# EAGLE design Water Use Monitor (EAGLE 6.5.0)

## Sheet 1 of 2
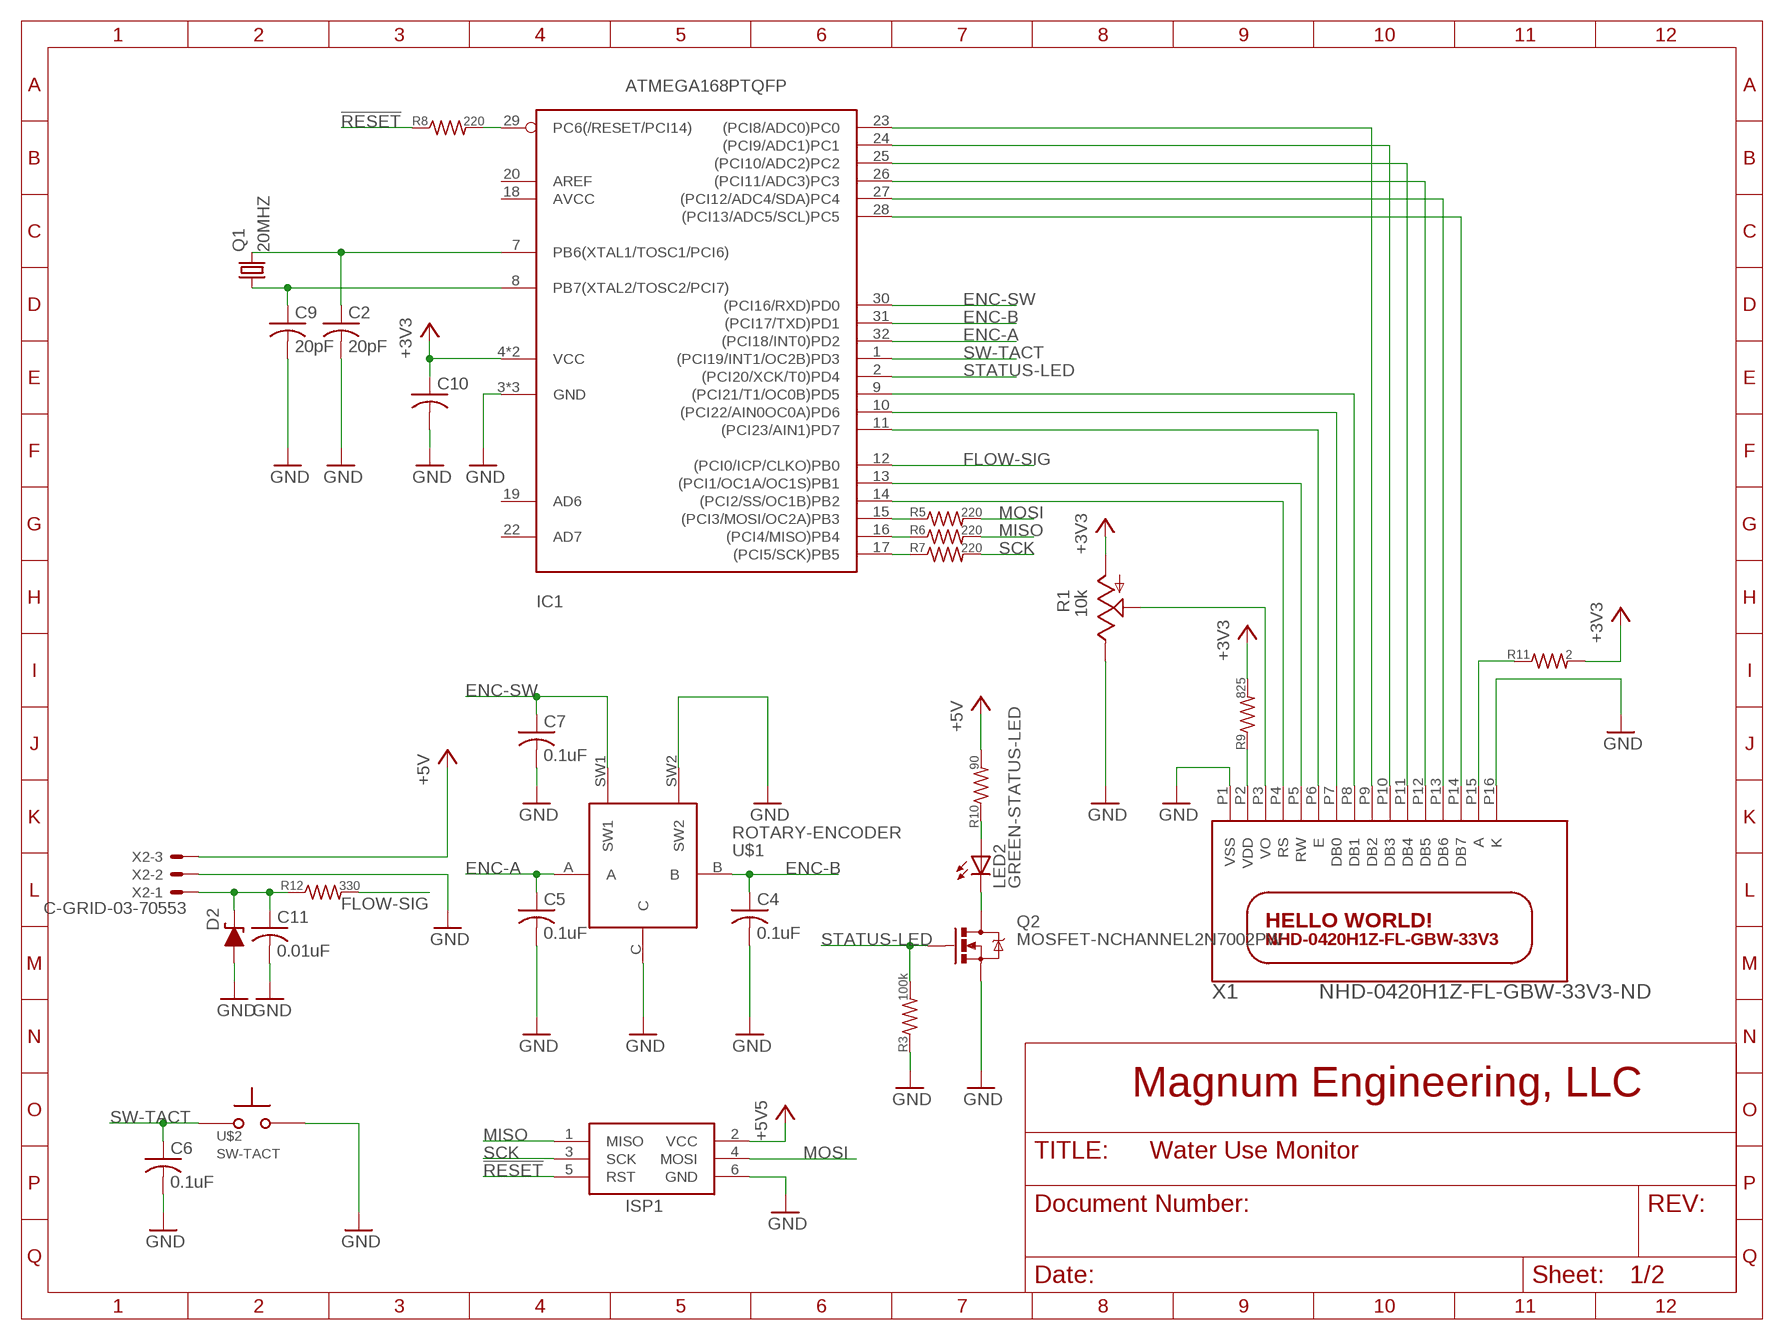
[diagram p0: schematic, sheet 1]

### Parts
C2  20pF  CAPACITOR0805  [C0805]
C4  0.1uF  CAPACITOR0805  [C0805]
C5  0.1uF  CAPACITOR0805  [C0805]
C6  0.1uF  CAPACITOR0805  [C0805]
C7  0.1uF  CAPACITOR0805  [C0805]
C9  20pF  CAPACITOR0805  [C0805]
C10  CAPACITOR0805  [C0805]
C11  0.01uF  CAPACITOR0805  [C0805]
D2  ZENERSOD-123  [SOD-123]
IC1  ATMEGA168PTQFP  [ADS4_TQFP32-08]
ISP1  AVRISP-6  [AVRISP]
LED2  GREEN-STATUS-LED  LED5MM  [LED5MM]
Q1  20MHZ  CRYSTAL  [20MHZ]
Q2  MOSFET-NCHANNEL2N7002PW  [SOT323]
R1  10k  POTENTIOMETER  [POT_RS3]
R3  100k  RESISTOR0805  [R0805]
R5  220  RESISTOR0805  [R0805]
R6  220  RESISTOR0805  [R0805]
R7  220  RESISTOR0805  [R0805]
R8  220  RESISTOR0805  [R0805]
R9  825  RESISTOR0805  [R0805]
R10  90  RESISTOR0805  [R0805]
R11  2  RESISTOR0805  [R0805]
R12  330  RESISTOR0805  [R0805]
U$1  ROTARY-ENCODER  [ROTARY-ENCODER]
U$2  SW-TACT  [FSM15JLH]
X1  NHD-0420H1Z-FL-GBW-33V3-ND  HD44780LCD  [NEWHAVEN-LCD]
X2  C-GRID-03-70553  [70553-03]

### Nets
!RESET: ISP1.5(RST) R8.1
$N32: C11.1 D2.K R12.1 X2.1
+3V3: C10.1 IC1.4(VCC) IC1.6(VCC) R1.A R9.2 R11.2 ; also sheet 2
+5.5V: ISP1.2(VCC) ; supply symbol labelled +5V5
+5V: R10.2 X2.3 ; also sheet 2
ENC-A: C5.1 IC1.32((PCI18/INT0)PD2) U$1.A
ENC-B: C4.1 IC1.31((PCI17/TXD)PD1) U$1.B
ENC-SW: C7.1 IC1.30((PCI16/RXD)PD0) U$1.SW1
FLOW-SIG: IC1.12((PCI0/ICP/CLKO)PB0) R12.2
GND: C2.2 C4.2 C5.2 C6.2 C7.2 C9.2 C10.2 C11.2 D2.A IC1.3(GND) IC1.5(GND) IC1.21(GND) ISP1.6(GND) Q2.2(S) R1.E R3.1 U$1.C U$1.SW2 U$2.P$3 U$2.P$4 X1.P1(VSS) X1.P16(K) X2.2 ; also sheet 2
MISO: ISP1.1(MISO) R6.2
MOSI: ISP1.4(MOSI) R5.2
N$1: R1.S X1.P3(VO)
N$2: IC1.13((PCI1/OC1A/OC1S)PB1) X1.P5(RW)
N$3: IC1.14((PCI2/SS/OC1B)PB2) X1.P4(RS)
N$4: IC1.11((PCI23/AIN1)PD7) X1.P6(E)
N$5: IC1.10((PCI22/AIN0OC0A)PD6) X1.P7(DB0)
N$6: IC1.9((PCI21/T1/OC0B)PD5) X1.P8(DB1)
N$7: IC1.23((PCI8/ADC0)PC0) X1.P9(DB2)
N$8: IC1.24((PCI9/ADC1)PC1) X1.P10(DB3)
N$9: IC1.25((PCI10/ADC2)PC2) X1.P11(DB4)
N$10: IC1.26((PCI11/ADC3)PC3) X1.P12(DB5)
N$11: IC1.27((PCI12/ADC4/SDA)PC4) X1.P13(DB6)
N$12: IC1.28((PCI13/ADC5/SCL)PC5) X1.P14(DB7)
N$15: C2.1 IC1.7(PB6(XTAL1/TOSC1/PCI6)) Q1.P$2
N$16: C9.1 IC1.8(PB7(XTAL2/TOSC2/PCI7)) Q1.P$1
N$18: IC1.15((PCI3/MOSI/OC2A)PB3) R5.1
N$19: IC1.16((PCI4/MISO)PB4) R6.1
N$20: IC1.17((PCI5/SCK)PB5) R7.1
N$21: IC1.29(PC6(/RESET/PCI14)) R8.2
N$22: R11.1 X1.P15(A)
N$26: LED2.K(C) Q2.3(D)
N$27: LED2.A R10.1
SCK: ISP1.3(SCK) R7.2
STATUS-LED: IC1.2((PCI20/XCK/T0)PD4) Q2.1(G) R3.2
SW-TACT: C6.1 IC1.1((PCI19/INT1/OC2B)PD3) U$2.P$1 U$2.P$2
VDD: R9.1 X1.P2(VDD)
Unconnected: IC1.18(AVCC) IC1.19(AD6) IC1.20(AREF) IC1.22(AD7)

## Sheet 2 of 2
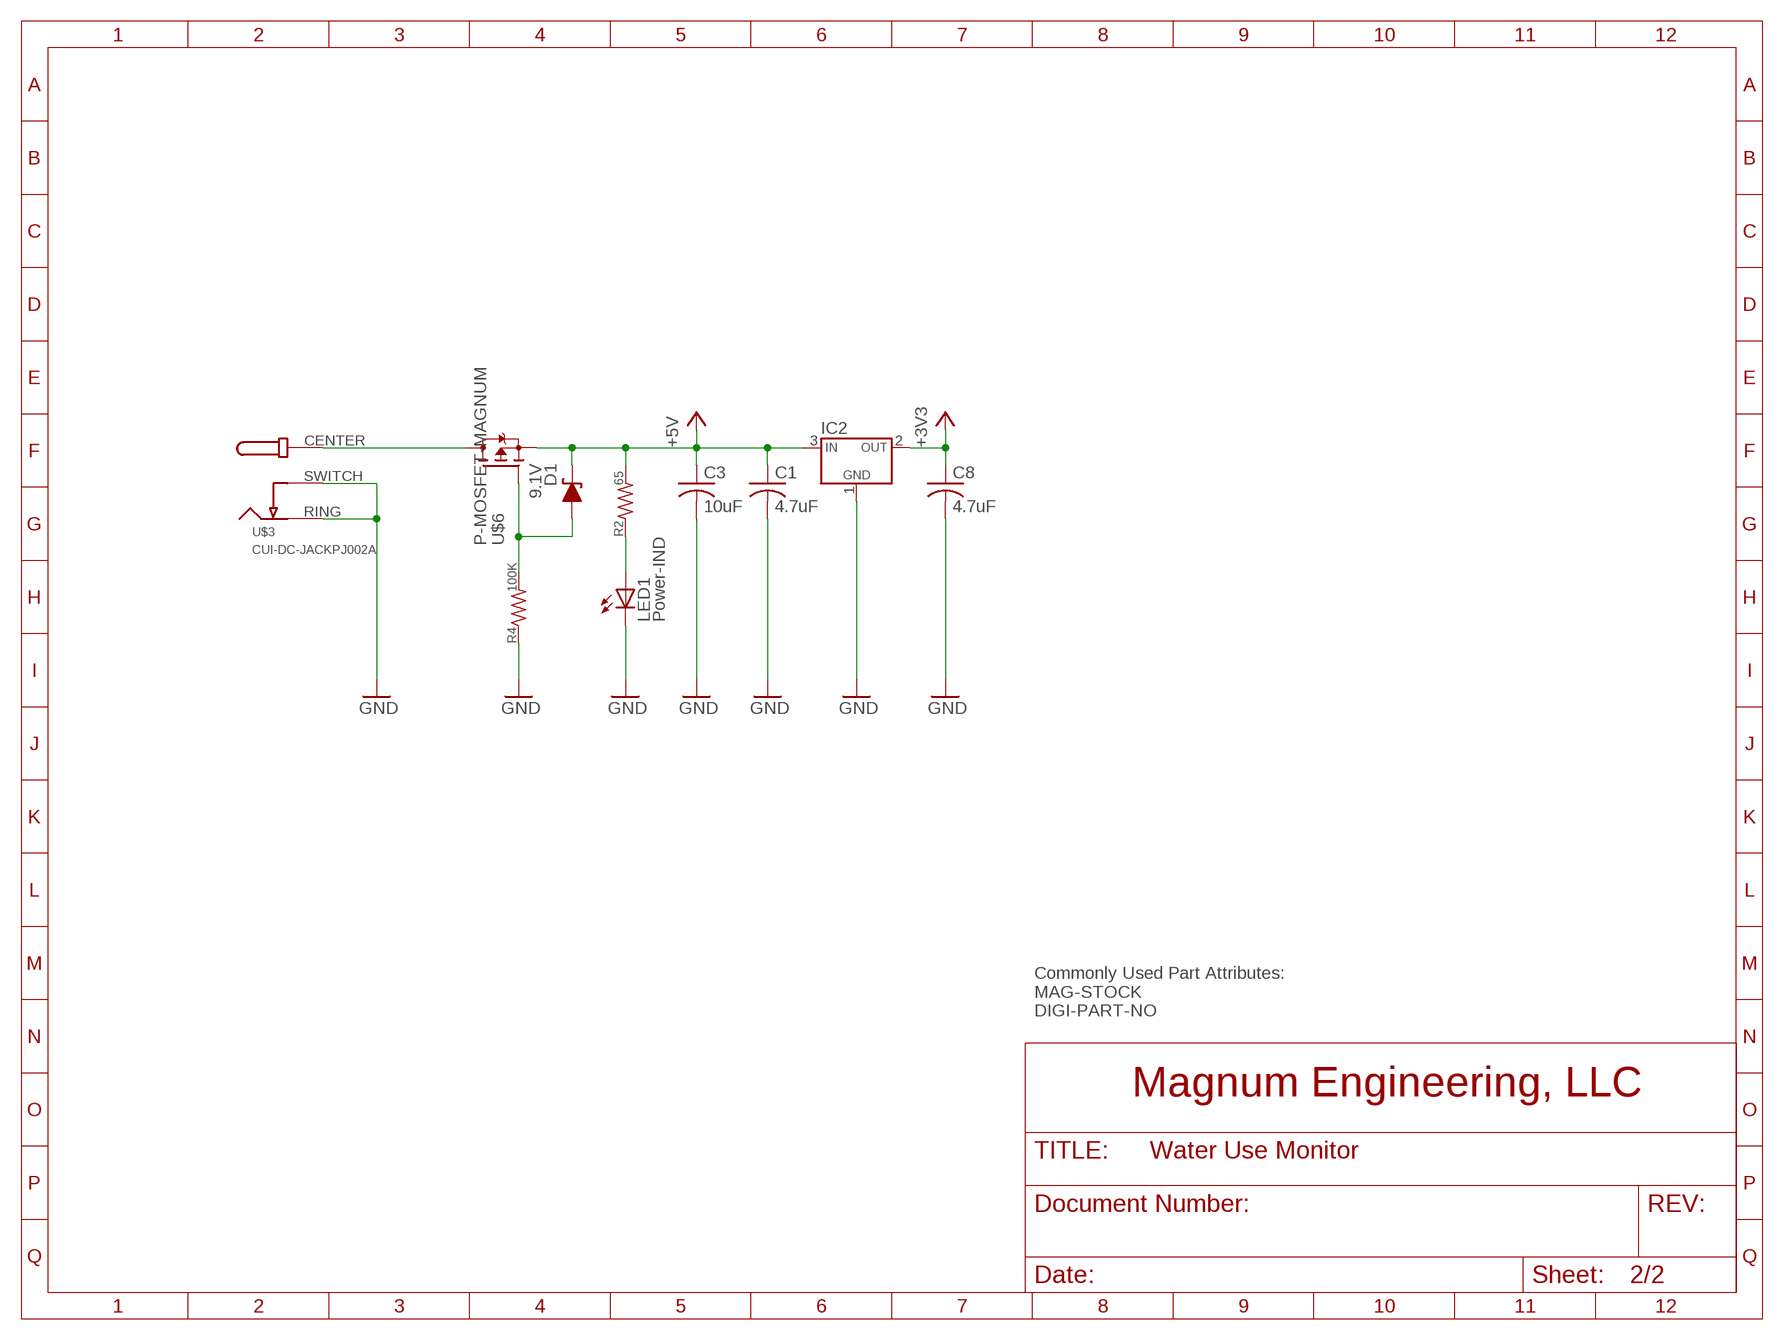
[diagram p1: schematic, sheet 2]

### Parts
C1  4.7uF  CAPACITOR0805  [C0805]
C3  10uF  CAPACITOR0805  [C0805]
C8  4.7uF  CAPACITOR0805  [C0805]
D1  9.1V  ZENERSOT-23  [SOT-23]
IC2  VREGLD1117-XX  [DPAK]
LED1  Power-IND  LED5MM  [LED5MM]
R2  65  RESISTOR0805  [R0805]
R4  100K  RESISTOR0805  [R0805]
U$3  CUI-DC-JACKPJ002A  [PJ002A]
U$6  P-MOSFET-MAGNUM  [SOT23]

### Nets
+3V3: C8.1 IC2.2(OUT) ; also sheet 1
+5V: C1.1 C3.1 D1.3(K) IC2.3(IN) R2.2 U$6.2(S) ; also sheet 1
GND: C1.2 C3.2 C8.2 IC2.1(GND) LED1.K(C) R4.1 U$3.RING U$3.SWITCH(SW) ; also sheet 1
N$13: U$3.CENTER U$6.3(D)
N$14: D1.1(A) R4.2 U$6.1(G)
N$17: LED1.A R2.1

### Notes on the sheet
- Commonly Used Part Attributes:
  MAG-STOCK
  DIGI-PART-NO

## Library data of the parts
C1-C11 = Magnum Stock Parts:CAPACITOR
D1 = Magnum Stock Parts:ZENER: Zener Diode; DIGI-PART-NO: BZX84C9V1-FDICT-ND
D2 = Magnum Stock Parts:ZENER: Zener Diode
IC1 = Water Use:ATMEGA168*P: MICROCONTROLLER 16 kBytes FLASH 1 kBytes SRAM 512 Bytes EEPROM USART 8-channel 10 bit ADC; DIGI-PART-NO: ATMEGA168PA-AURCT-ND
IC2 = Magnum Stock Parts:VREG; MAG-STOCK: YES
ISP1 = Water Use:AVRISP: AVR ISP HEADER Standard 6 pin header for AVR programming
LED1 = led:LED: LED OSRAM: - CHIPLED LG R971, LG N971, LY N971, LG Q971, LY Q971, LO R971, LY R971 LH N974, LH R974 LS Q976, LO Q976, LY Q976 LO Q996 - Hyper CHIPLED LW Q18S LB Q993, LB Q99A, LB R99A - SideLED LS A670, LO A670, LY A670, LG A670, LP A670 LB A673, LV A673, LT A673, LW A673 LH A674 LY A675 LS A676, LA A676, LO A676, LY A676, LW A676 LS A679, LY A679, LG A679 - Hyper Micro SIDELED® LS Y876, LA Y876, LO Y876, LY Y876 LT Y87S - SmartLED LW L88C, LW L88S LB L89C, LB L89S, LG L890 LS L89K, LO L89K, LY L89K LS L896, LA L896, LO L896, LY L896 - TOPLED LS T670, LO T670, LY T670, LG T670, LP T670 LSG T670, LSP T670, LSY T670, LOP T670, LYG T670 LG T671, LOG T671, LSG T671 LB T673, LV T673, LT T673, LW T673 LH T674 LS T676, LA T676, LO T676, LY T676, LB T676, LH T676, LSB T676, LW T676 LB T67C, LV T67C, LT T67C, LS T67K, LO T67K, LY T67K, LW E67C LS E67B, LA E67B, LO E67B, LY E67B, LB E67C, LV E67C, LT E67C LW T67C LS T679, LY T679, LG T679 LS T770, LO T770, LY T770, LG T770, LP T770 LB T773, LV T773, LT T773, LW T773 LH T774 LS E675, LA E675, LY E675, LS T675 LS T776, LA T776, LO T776, LY T776, LB T776 LHGB T686 LT T68C, LB T68C - Hyper Mini TOPLED® LB M676 - Mini TOPLED Santana® LG M470 LS M47K, LO M47K, LY M47K Source: http://www.osram.convergy.de LUXEON: - LUMILED® LXK2-PW12-R00, LXK2-PW12-S00, LXK2-PW14-U00, LXK2-PW14-V00 LXK2-PM12-R00, LXK2-PM12-S00, LXK2-PM14-U00 LXK2-PE12-Q00, LXK2-PE12-R00, LXK2-PE12-S00, LXK2-PE14-T00, LXK2-PE14-U00 LXK2-PB12-K00, LXK2-PB12-L00, LXK2-PB12-M00, LXK2-PB14-N00, LXK2-PB14-P00, LXK2-PB14-Q00 LXK2-PR12-L00, LXK2-PR12-M00, LXK2-PR14-Q00, LXK2-PR14-R00 LXK2-PD12-Q00, LXK2-PD12-R00, LXK2-PD12-S00 LXK2-PH12-R00, LXK2-PH12-S00 LXK2-PL12-P00, LXK2-PL12-Q00, LXK2-PL12-R00 Source: www.luxeon.com KINGBRIGHT: KA-3528ASYC Source: www.kingbright.com; DIGI-PART-NO: 365-1189-ND
LED2 = led:LED: LED OSRAM: - CHIPLED LG R971, LG N971, LY N971, LG Q971, LY Q971, LO R971, LY R971 LH N974, LH R974 LS Q976, LO Q976, LY Q976 LO Q996 - Hyper CHIPLED LW Q18S LB Q993, LB Q99A, LB R99A - SideLED LS A670, LO A670, LY A670, LG A670, LP A670 LB A673, LV A673, LT A673, LW A673 LH A674 LY A675 LS A676, LA A676, LO A676, LY A676, LW A676 LS A679, LY A679, LG A679 - Hyper Micro SIDELED® LS Y876, LA Y876, LO Y876, LY Y876 LT Y87S - SmartLED LW L88C, LW L88S LB L89C, LB L89S, LG L890 LS L89K, LO L89K, LY L89K LS L896, LA L896, LO L896, LY L896 - TOPLED LS T670, LO T670, LY T670, LG T670, LP T670 LSG T670, LSP T670, LSY T670, LOP T670, LYG T670 LG T671, LOG T671, LSG T671 LB T673, LV T673, LT T673, LW T673 LH T674 LS T676, LA T676, LO T676, LY T676, LB T676, LH T676, LSB T676, LW T676 LB T67C, LV T67C, LT T67C, LS T67K, LO T67K, LY T67K, LW E67C LS E67B, LA E67B, LO E67B, LY E67B, LB E67C, LV E67C, LT E67C LW T67C LS T679, LY T679, LG T679 LS T770, LO T770, LY T770, LG T770, LP T770 LB T773, LV T773, LT T773, LW T773 LH T774 LS E675, LA E675, LY E675, LS T675 LS T776, LA T776, LO T776, LY T776, LB T776 LHGB T686 LT T68C, LB T68C - Hyper Mini TOPLED® LB M676 - Mini TOPLED Santana® LG M470 LS M47K, LO M47K, LY M47K Source: http://www.osram.convergy.de LUXEON: - LUMILED® LXK2-PW12-R00, LXK2-PW12-S00, LXK2-PW14-U00, LXK2-PW14-V00 LXK2-PM12-R00, LXK2-PM12-S00, LXK2-PM14-U00 LXK2-PE12-Q00, LXK2-PE12-R00, LXK2-PE12-S00, LXK2-PE14-T00, LXK2-PE14-U00 LXK2-PB12-K00, LXK2-PB12-L00, LXK2-PB12-M00, LXK2-PB14-N00, LXK2-PB14-P00, LXK2-PB14-Q00 LXK2-PR12-L00, LXK2-PR12-M00, LXK2-PR14-Q00, LXK2-PR14-R00 LXK2-PD12-Q00, LXK2-PD12-R00, LXK2-PD12-S00 LXK2-PH12-R00, LXK2-PH12-S00 LXK2-PL12-P00, LXK2-PL12-Q00, LXK2-PL12-R00 Source: www.luxeon.com KINGBRIGHT: KA-3528ASYC Source: www.kingbright.com; DIGI-PART-NO: 516-1347-ND
Q1 = Water Use:CRYSTAL: CRYSTAL; DIGI-PART-NO: XC1291CT-ND
Q2 = SparkFun-DiscreteSemi:MOSFET-NCHANNEL: Common NMOSFET Parts MFG P/N Store ID Prod ID FDD8780 TRANS-09984 SI7820DN TRANS-11055 FDS6630A IC-08089 2N7002PW TRANS-11151 FQP30N06L COM-10213 TRANS-10060 BSS123LT1G TRANS-08345 BSS138 TRANS-00830 BS170 2N7000; PROD_ID: TRANS-11151
R1 = Magnum Stock Parts:POTENTIOMETER: Bourns 3386 Series PTH Potentiometer
R2-R12 = Magnum Stock Parts:RESISTOR
U$1 = Water Use:ROTARY-ENCODER; DIGI-PART-NO: 987-1186-ND
U$2 = Water Use:SW-TACT
U$3 = Water Use:CUI-DC-JACK
U$6 = Water Use:P-MOSFET-MAGNUM; MAG-STOCK: YES
X1 = Water Use:HD44780LCD: NEWHAVEN NHD-0420H1Z-FL-GBW-33V3 Character Display Standard Character Display Size 20x40; DIGI-PART-NO: NHD-0420H1Z-FL-GBW-33V3-ND
X2 = con-molex:C-GRID-03: CONNECTOR wire to board 2.54 mm (0.100") pitch header; OC_FARNELL: unknown; OC_NEWARK: unknown

## Board
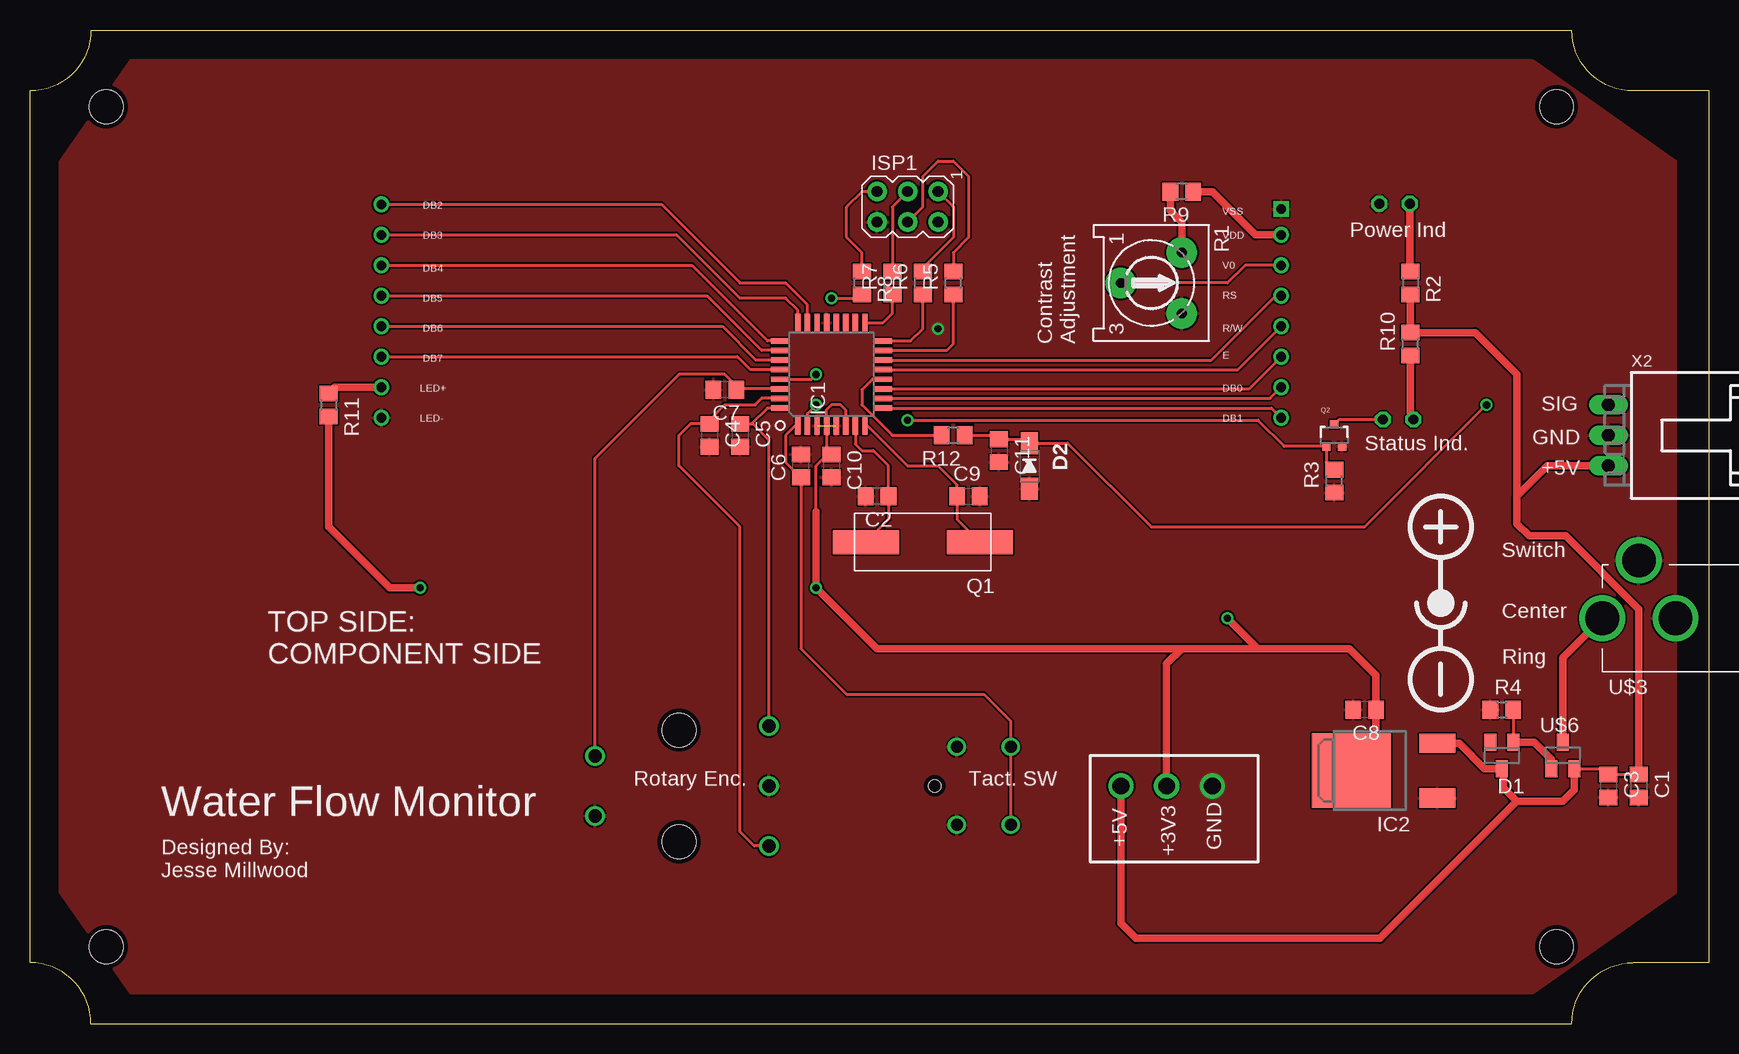
[diagram p2: board, top side]
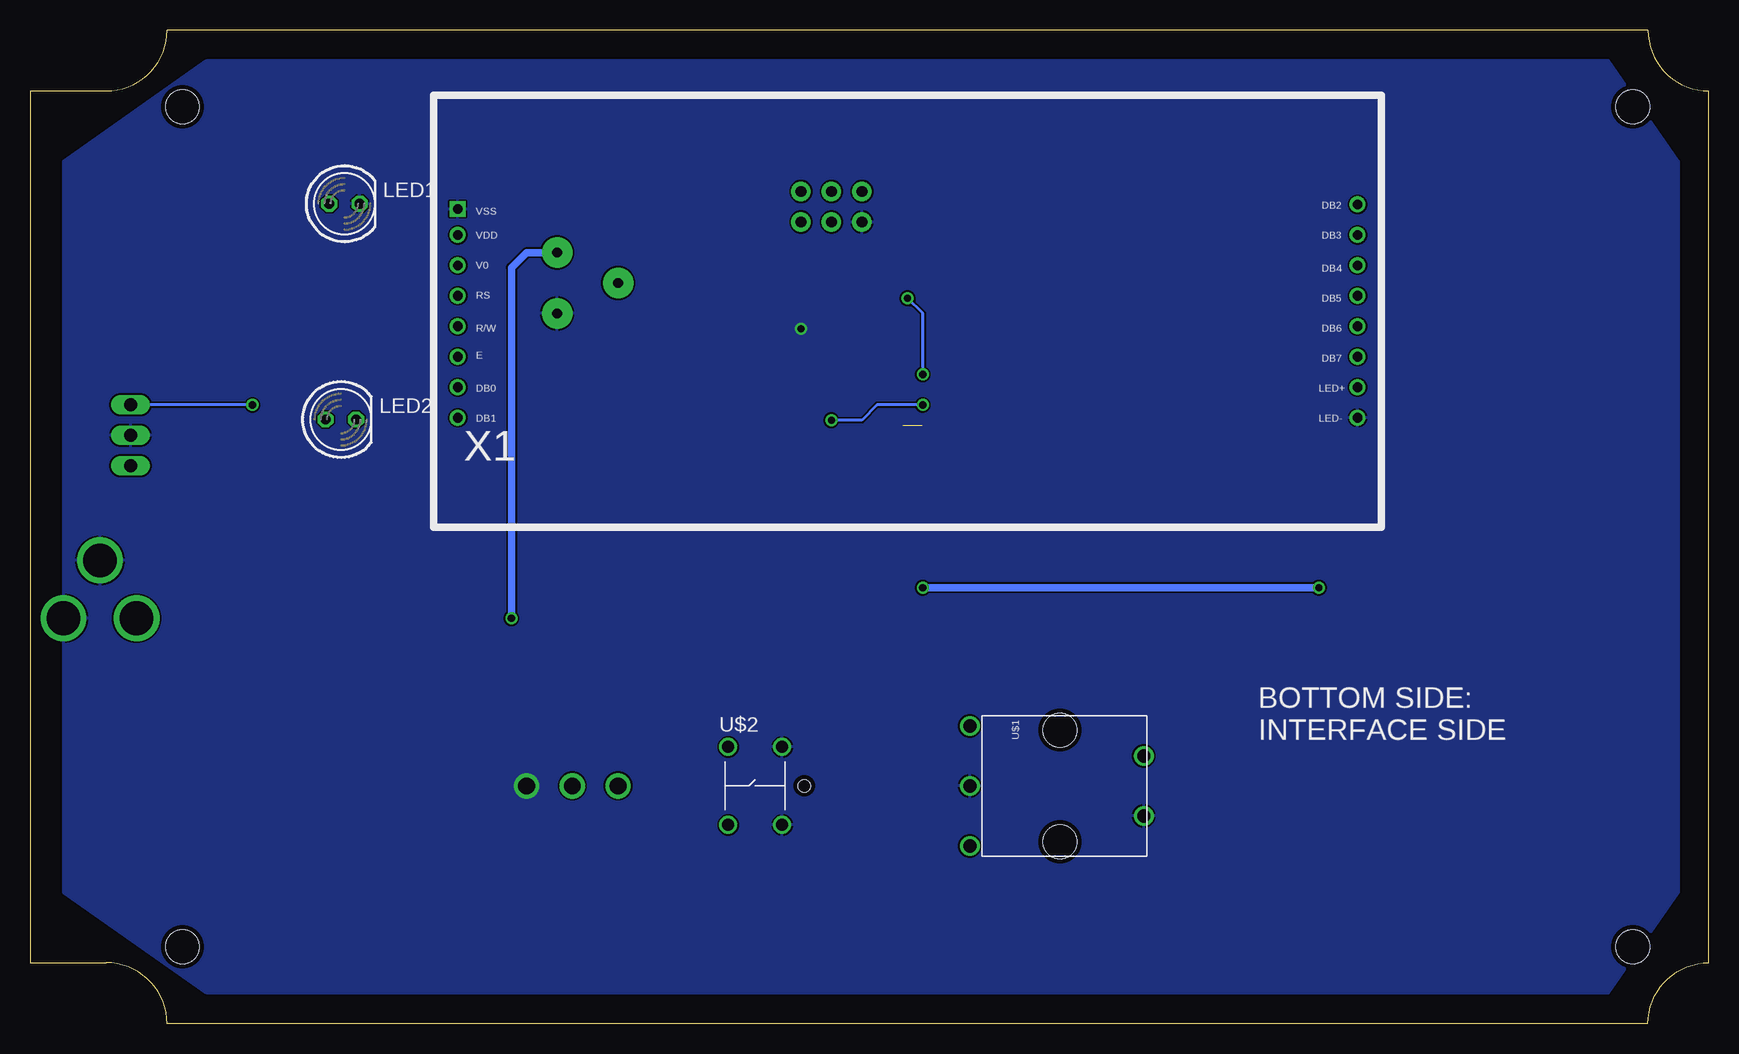
[diagram p3: board, bottom side, seen from below]

Size 139.95 x 82.8 mm. Coordinates in mm from the lower left corner, seen from the top.
Outline: 5.08,82.8 128.52,82.8 arc90 133.6,77.72 139.95,77.72 139.95,5.08 133.6,5.08 arc90 128.52,0 5.08,0 arc90 0,5.08 0,77.72 arc90 5.08,82.8
Copper layers (1*16): Top 0.035mm / dielectric 1.5mm / Bottom 0.035mm
Design rules "Magnum 6mil": minimum track width 6mil, minimum drill 15mil, track to track 6mil, track to pad 6mil, pad to pad 6mil, via to via 6mil, smd to smd 6mil, copper to edge 15mil, drill to drill 8mil, minimum pad ring 10mil, minimum via ring 8mil, stop-mask expansion 4mil, vias tented up to drill 0mil, thermal gap 6mil

### Footprints (pad centres in the part's own frame; a part is rotated, then mirrored left to right if it is on the bottom)
C0805 = smd 1.3 x 1.5: 1 -0.95,0; 2 0.95,0
SOT-23 = smd 1 x 1.4: 1 -0.95,-1.1; 2 0.95,-1.1; 3 0,1.1
SOD-123 = smd 1.83 x 1.4: A 1.9,0; K -1.9,0
ADS4_TQFP32-08 = smd 1.5 x 0.45: 1 -4.293,2.8; 2 -4.293,2; 3 -4.293,1.2; 4 -4.293,0.4; 5 -4.293,-0.4; 6 -4.293,-1.2; 7 -4.293,-2; 8 -4.293,-2.8; 17 4.293,-2.8; 18 4.293,-2; 19 4.293,-1.2; 20 4.293,-0.4; 21 4.293,0.4; 22 4.293,1.2; 23 4.293,2; 24 4.293,2.8 | smd 0.45 x 1.5: 9 -2.8,-4.293; 10 -2,-4.293; 11 -1.2,-4.293; 12 -0.4,-4.293; 13 0.4,-4.293; 14 1.2,-4.293; 15 2,-4.293; 16 2.8,-4.293; 25 2.8,4.293; 26 2,4.293; 27 1.2,4.293; 28 0.4,4.293; 29 -0.4,4.293; 30 -1.2,4.293; 31 -2,4.293; 32 -2.8,4.293
DPAK = smd 1.6 x 3: 1 -2.28,-4.8; 3 2.28,-4.8 | smd 6.2 x 6.6: 2 0,2.38
AVRISP = drill 0.9 pad 1.626: 1 -1.27,2.54; 2 1.27,2.54; 3 -1.27,0; 4 1.27,0; 5 -1.27,-2.54; 6 1.27,-2.54
LED5MM = drill 0.813 octagon: A -1.27,0; K 1.27,0
20MHZ = smd 5.5 x 2: P$1 -4.75,0; P$2 4.75,0
SOT323 = smd 0.7 x 0.7: 1 -0.65,-0.925; 2 0.65,-0.925; 3 0,0.925
POT_RS3 = drill 0.813 pad 2.54: A -2.54,2.54; E 2.54,2.54; S 0,-2.54
R0805 = smd 1.3 x 1.5: 1 -0.95,0; 2 0.95,0
ROTARY-ENCODER = drill 1.1: A -5,-7.5; B 5,-7.5; C 0,-7.5; SW1 -2.5,7; SW2 2.5,7 | hole 2.8: -4.65,0; 4.65,0
FSM15JLH = drill 1: P$1 -2.25,3.25; P$2 -2.25,-3.25; P$3 2.25,3.25; P$4 2.25,-3.25 | hole 1: 4.09,0
PJ002A = drill 2.8: CENTER 0,-3.048; RING 0,3.048; SWITCH -4.826,0
SOT23 = smd 1 x 1.4: 1 -0.95,-1.1; 2 0.95,-1.1; 3 0,1.1
POLYCASE-SL64B = hole 2.8: -60.452,35.001; 60.452,35.001; 60.452,-35.001; -60.452,-35.001
NEWHAVEN-LCD = drill 0.8 square: P1 -37.5,8.5 | drill 0.8: P2 -37.5,6.35; P3 -37.5,3.81; P4 -37.5,1.27; P5 -37.5,-1.27; P6 -37.5,-3.81; P7 -37.5,-6.35; P8 -37.5,-8.89; P9 37.5,8.89; P10 37.5,6.35; P11 37.5,3.81; P12 37.5,1.27; P13 37.5,-1.27; P14 37.5,-3.81; P15 37.5,-6.35; P16 37.5,-8.89
70553-03 = drill 1.092 long: 1 -2.54,-7.62; 2 0,-7.62; 3 2.54,-7.62

### Placement (x,y rotation side)
C1  134.11,19.81 270 top
C2  70.61,43.94 180 top
C3  131.57,19.81 270 top
C4  56.64,49.02 270 top
C5  59.18,49.02 270 top
C6  64.26,46.48 90 top
C7  57.91,52.83 180 top
C8  111.25,26.16 180 top
C9  78.23,43.94 0 top
C10  66.8,46.48 270 top
C11  80.77,47.75 270 top
D1  122.68,22.35 180 top
D2  83.31,46.48 270 top
IC1  66.8,54.1 90 top
IC2  112.52,21.08 90 top
ISP1  73.15,68.07 270 top
LED1  113.74,68.33 0 bottom
LED2  114.05,50.34 0 bottom
Q1  74.42,40.13 180 top
Q2  108.71,49.02 0 top
R1  93.47,61.72 270 top
R2  115.06,61.72 270 top
R3  108.71,45.21 90 top
R4  122.68,26.16 0 top
R5  76.96,61.72 90 top
R6  74.42,61.72 90 top
R7  71.88,61.72 90 top
R8  69.34,61.72 270 top
R9  96.01,69.34 180 top
R10  115.06,56.64 90 top
R11  24.89,51.56 270 top
R12  76.96,49.02 180 top
U$1  54.1,19.81 270 bottom
U$2  79.5,19.81 0 bottom
U$3  134.11,33.78 270 top
U$5  [DC-POLARITY]  117.6,35.05 90 top
U$6  127.76,22.35 0 top
U$7  [POLYCASE-SL64B]  66.8,41.4 0 top
X1  66.8,59.39 0 bottom
X2  139.19,49.02 270 top

### Tracks (layer width: path | path; a pad name or v marks a point on that pad's centre or on a via)
!RESET
  Top 0.254: ISP1.5 69.34,69.34 68.07,68.07 68.07,65.53 69.34,64.26 R8.1
$N32  (via drill 0.6)
  Top 0.254: R12.1 80.77,49.02 C11.1 83.31,48.7 D2.K 86.49,48.38 93.47,41.4 111.25,41.4 v121.41,51.56
  Bottom 0.254: v121.41,51.56 X2.1
+3V3  (via drill 0.6, 1.4)
  Top 0.254: IC1.6 68,51.12 67.56,51.56 66.8,51.56 66.4,51.16 IC1.4 66.4,47.83 C10.1 66.48,47.43 65.53,46.48 65.53,42.67 | 112.2,23.14 IC2.2
  Top 0.61: R9.2 95.06,67.75 96.01,66.8 R1.A | 112.2,23.14 C8.1 112.2,29.02 109.98,31.24 102.36,31.24 | 102.36,31.24 96.01,31.24 | 96.01,31.24 70.61,31.24 v65.53,36.32 65.53,42.67 | v99.82,33.78 102.36,31.24 | v94.74,19.81 94.74,29.97 96.01,31.24 | R11.2 24.89,41.4 29.97,36.32 v32.51,36.32
  Bottom 0.61: R1.A 98.55,64.26 99.82,62.99 v99.82,33.78 | v32.51,36.32 v65.53,36.32
+5V  (via drill 1.4)
  Top 0.254: 122.83,21.4 D1.3 | C1.1 C3.1 131.08,21.25 U$6.2
  Top 0.61: R2.2 R10.2 120.46,57.59 123.95,54.1 123.95,43.94 | X2.3 126.49,46.48 123.95,43.94 | IC2.3 119.13,23.36 121.24,21.25 D1.3 | 122.83,21.4 122.83,19.66 123.95,18.54 | 123.95,18.54 127.76,18.54 128.71,19.49 U$6.2 | C1.1 134.11,34.54 128.02,40.64 124.97,40.64 123.95,41.66 123.95,43.94 | 123.95,18.54 112.52,7.11 92.2,7.11 90.93,8.38 v90.93,19.81
ENC-A
  Top 0.254: U$1.A 61.6,48.63 60.26,49.97 C5.1 60.13,49.97 61.46,51.3 IC1.32
ENC-B
  Top 0.254: U$1.B 60.37,14.81 59.18,16 59.18,41.4 54.1,46.48 54.1,49.02 55.05,49.97 C4.1 56.64,50.29 57.91,51.56 60.45,51.56 60.99,52.1 IC1.31
ENC-SW
  Top 0.254: U$1.SW1 47.1,47.1 54.1,54.1 57.91,54.1 58.86,53.15 C7.1 58.93,52.9 IC1.30
FLOW-SIG
  Top 0.254: IC1.12 70.21,53.7 69.34,52.83 69.34,51.56 71.88,49.02 R12.2
GND  (via drill 0.6, 1.4)  (1 unrouted)
  other vias: 75.69,57.91 98.55,19.81
  pour Top: 8.38,80.26 125.22,80.26 137.16,71.88 137.16,10.92 125.22,2.54 8.38,2.54 2.54,10.92 2.54,71.88
  pour Bottom: 8.38,2.54 125.22,2.54 137.16,10.92 137.16,71.88 125.22,80.26 8.38,80.26 2.54,71.88 2.54,10.92
MISO
  Top 0.254: ISP1.1 76.96,68.07 76.96,65.53 74.42,62.99 R6.2
MOSI
  Top 0.254: ISP1.4 74.42,68.07 74.42,70.61 75.69,71.88 76.96,71.88 78.23,70.61 78.23,65.53 76.96,64.26 R5.2
N$1
  Top 0.254: X1.P3 101.3,63.2 99.82,61.72 R1.S
N$2
  Top 0.254: IC1.13 100.69,54.5 X1.P5
N$3
  Top 0.254: IC1.14 98.48,55.3 103.84,60.66 X1.P4
N$4
  Top 0.254: IC1.11 101.63,52.9 X1.P6
N$5
  Top 0.254: IC1.10 103.37,52.1 X1.P7
N$6
  Top 0.254: IC1.9 103.5,51.3 X1.P8
N$7
  Top 0.254: X1.P9 52.63,68.28 59.18,61.72 62.99,61.72 64.8,59.91 IC1.23
N$8
  Top 0.254: X1.P10 53.9,65.73 59.18,60.45 62.99,60.45 64,59.44 IC1.24
N$9
  Top 0.254: X1.P11 55.17,63.2 61.46,56.9 IC1.25
N$10
  Top 0.254: X1.P12 56.44,60.66 60.99,56.1 IC1.26
N$11
  Top 0.254: X1.P13 57.71,58.12 60.52,55.3 IC1.27
N$12
  Top 0.254: X1.P14 58.98,55.58 60.05,54.5 IC1.28
N$13
  Top 0.61: U$6.3 127.76,30.48 U$3.CENTER
N$14
  Top 0.254: 123.78,23.3 D1.1 R4.2 | U$6.1 126.81,22.03
  Top 0.61: D1.1 125.39,23.45 126.81,22.03
N$15
  Top 0.254: IC1.7 68.8,48.29 69.34,47.75 70.29,47.75 71.56,46.48 C2.1 71.56,42.02 Q1.P$2
N$16
  Top 0.254: IC1.8 69.83,49.81 73.15,46.48 75.69,46.48 77.28,44.89 C9.1 77.28,42.02 Q1.P$1
N$17
  Top 0.254: 115.01,62.72 R2.1
  Top 0.61: LED1.A 115.01,62.72
N$18
  Top 0.254: IC1.15 76.42,56.1 76.96,56.64 R5.1
N$19
  Top 0.254: IC1.16 73.41,56.9 74.42,57.91 R6.1
N$20
  Top 0.254: IC1.17 71.1,58.39 71.88,59.18 R7.1
N$21  (via drill 0.6)
  Top 0.254: IC1.29 65.13,53.7 v65.53,54.1 | v66.8,60.45 69.02,60.45 R8.2
  Bottom 0.254: v65.53,54.1 65.53,59.18 v66.8,60.45
N$22
  Top 0.61: X1.P15 25.42,53.03 R11.1
N$26
  Top 0.254: LED2.K 109.11,50.34 Q2.3
N$27
  Top 0.61: R10.1 115.06,50.6 LED2.A
SCK
  Top 0.254: ISP1.3 71.88,68.07 R7.2
STATUS-LED  (via drill 0.6)
  Top 0.254: IC1.2 64.8,50.83 v65.53,51.56 | v73.15,50.29 102.36,50.29 104.56,48.1 Q2.1 108.06,46.81 R3.2
  Bottom 0.254: v65.53,51.56 69.34,51.56 70.61,50.29 v73.15,50.29
SW-TACT
  Top 0.254: U$2.P$2 U$2.P$1 81.75,25.18 79.5,27.43 68.07,27.43 64.26,31.24 C6.1 62.99,46.8 62.99,49.02 63.78,49.81 IC1.1
VDD
  Top 0.61: R9.1 98.55,69.34 102.16,65.73 X1.P2

### Text on the board
tPlace: Power Ind | Contrast / Adjustment | SIG | GND | Status Ind. | +5V | TOP SIDE: / COMPONENT SIDE | Rotary Enc. | Tact. SW | Water Flow Monitor | +5V | +3V3 | GND | Designed By: / Jesse Millwood
bPlace: BOTTOM SIDE: / INTERFACE SIDE
Notes: USER RIGHT | USER LEFT